# EAGLE schematic EstlCam board v3 (EAGLE 9.3.1)
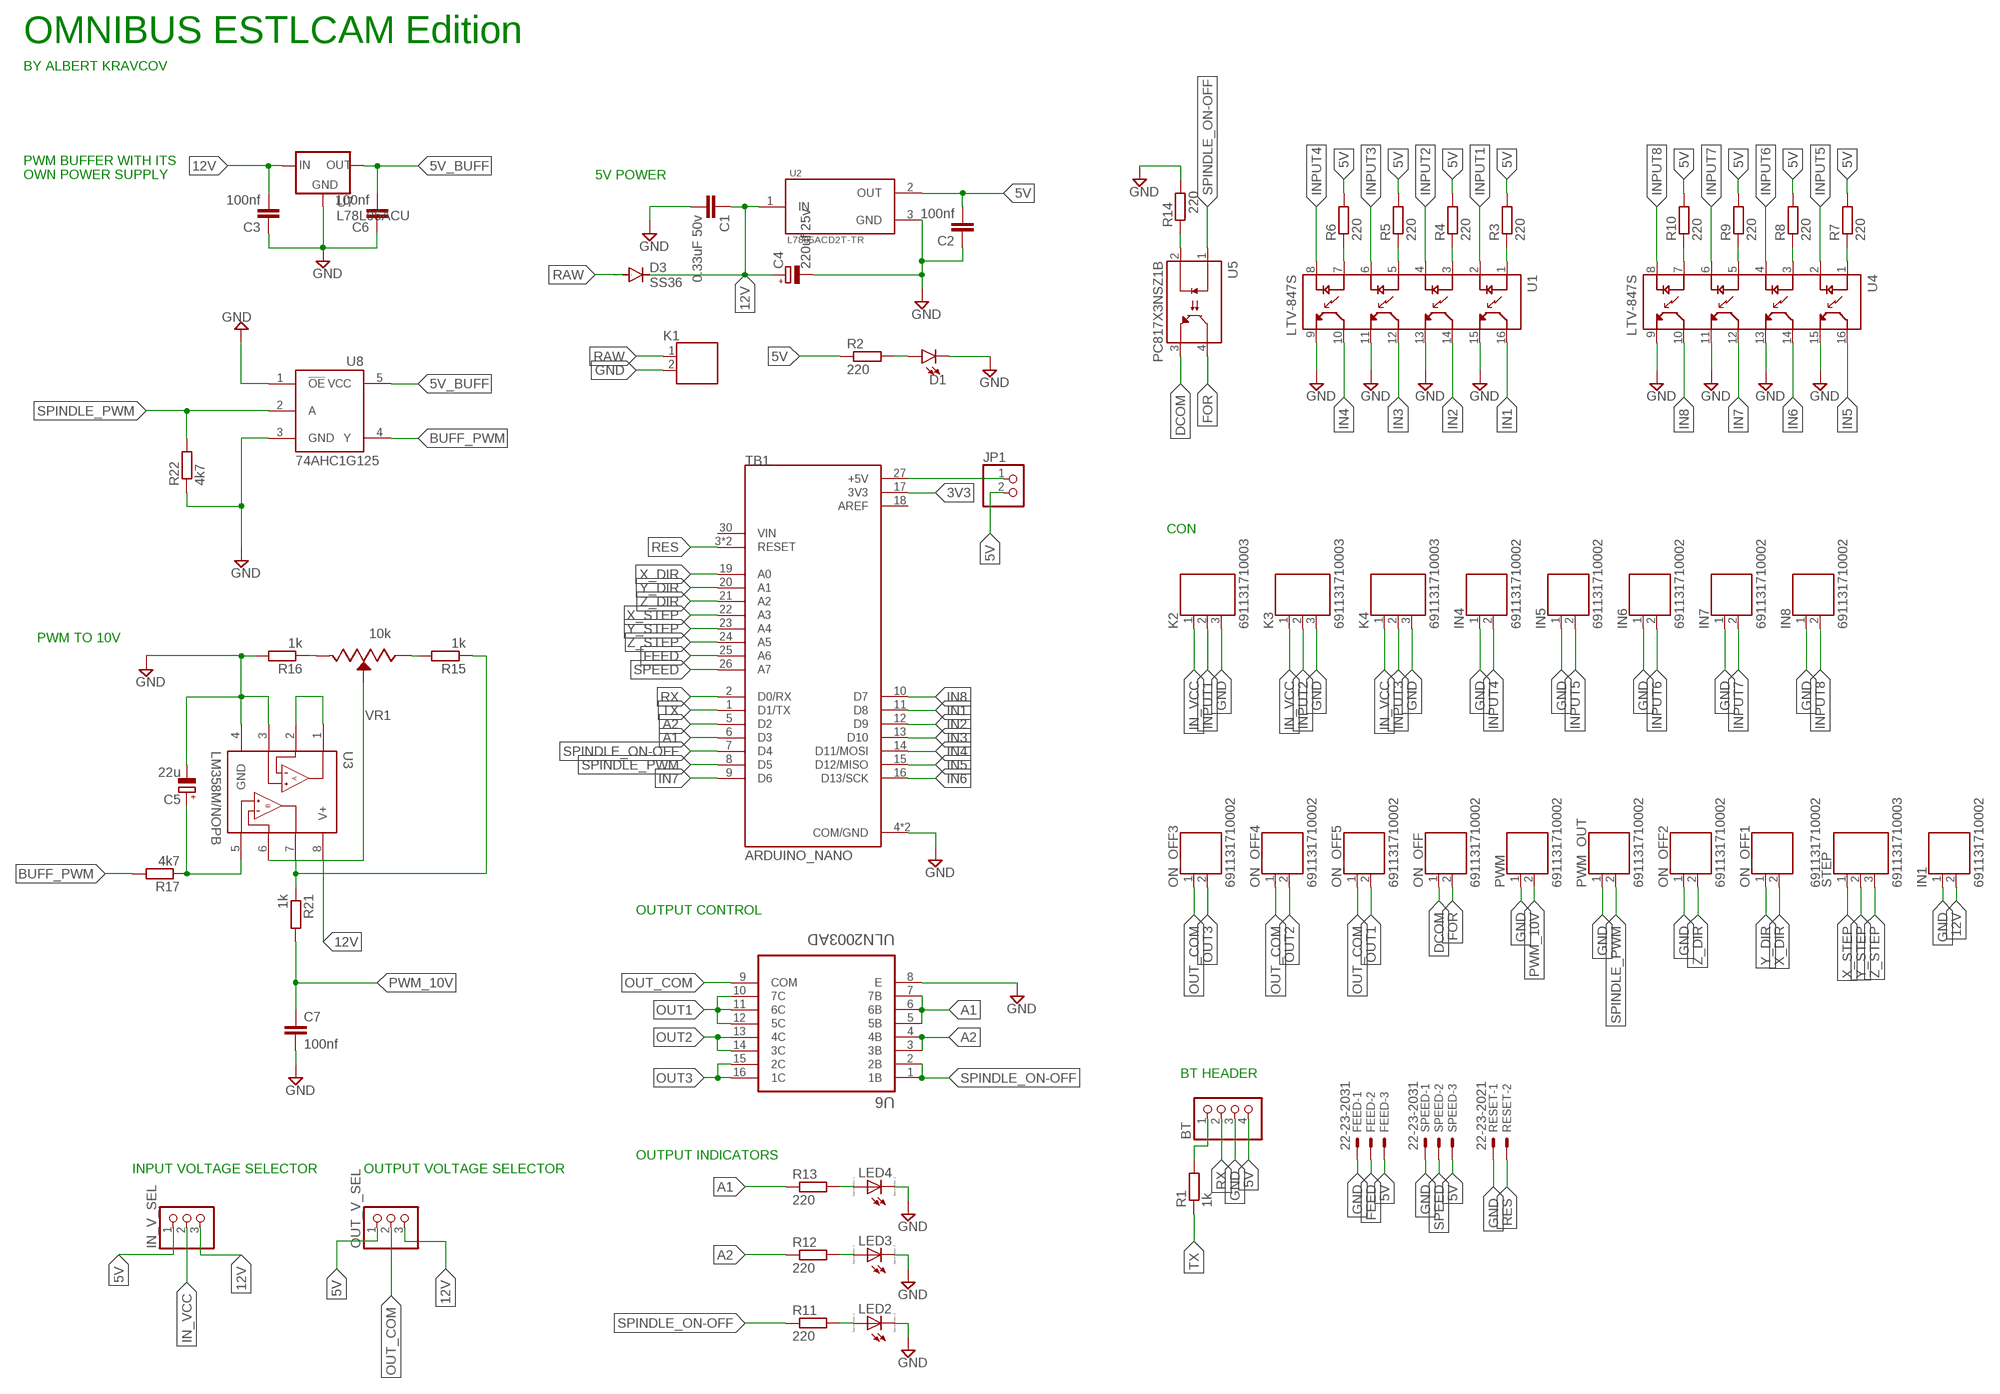
[diagram p0: schematic, sheet 1]

## Parts
BT  PINHD-1X4  [1X04]
C1  0.33uF 50v  C-EUC1206  [C1206]
C2  100nf  C-EUC0805  [C0805]
C3  100nf  C-EUC0805  [C0805]
C4  220uf 25v  CPOL-EUE5-6  [E5-6]
C5  22u  CPOL-EUE2-5  [E2-5]
C6  100nf  C-EUC0805  [C0805]
C7  100nf  C-EUC0805  [C0805]
D1  LED1206  [LED-1206]
D3  SS36  ES2D  [SMB]
FEED  22-23-2031  [22-23-2031]
IN1  691131710002  [691131710002]
IN4  691131710002  [691131710002]
IN5  691131710002  [691131710002]
IN6  691131710002  [691131710002]
IN7  691131710002  [691131710002]
IN8  691131710002  [691131710002]
IN_V_SEL  PINHD-1X3  [1X03]
JP1  PINHD-1X2  [1X02]
K1  691131710002  [691131710002]
K2  691131710003  [691131710003]
K3  691131710003  [691131710003]
K4  691131710003  [691131710003]
LED2  LED_ESML0603  [LED_SML0603]
LED3  LED_ESML0603  [LED_SML0603]
LED4  LED_ESML0603  [LED_SML0603]
ON_OFF  691131710002  [691131710002]
ON_OFF1  691131710002  [691131710002]
ON_OFF2  691131710002  [691131710002]
ON_OFF3  691131710002  [691131710002]
ON_OFF4  691131710002  [691131710002]
ON_OFF5  691131710002  [691131710002]
OUT_V_SEL  PINHD-1X3  [1X03]
PWM  691131710002  [691131710002]
PWM_OUT  691131710002  [691131710002]
R1  1k  R-EU_R0805  [R0805]
R2  220  R-EU_R0805  [R0805]
R3  220  R-EU_R0805  [R0805]
R4  220  R-EU_R0805  [R0805]
R5  220  R-EU_R0805  [R0805]
R6  220  R-EU_R0805  [R0805]
R7  220  R-EU_R0805  [R0805]
R8  220  R-EU_R0805  [R0805]
R9  220  R-EU_R0805  [R0805]
R10  220  R-EU_R0805  [R0805]
R11  220  R-EU_R0603  [R0603]
R12  220  R-EU_R0603  [R0603]
R13  220  R-EU_R0603  [R0603]
R14  220  R-EU_R0805  [R0805]
R15  1k  R-EU_R0805  [R0805]
R16  1k  R-EU_R0805  [R0805]
R17  4k7  R-EU_R0603  [R0603]
R21  1k  R-EU_R0805  [R0805]
R22  4k7  R-EU_R0805  [R0805]
RESET  22-23-2021  [22-23-2021]
SPEED  22-23-2031  [22-23-2031]
STEP  691131710003  [691131710003]
TB1  ARDUINO_NANO  [SHIELD_ARDUINO_NANO]
U1  LTV-847S  [SOIC254P1016X460-16N]
U2  L7805ACD2T-TR  [TO254P1515X470-3N]
U3  LM358M/NOPB  [SOIC127P599X175-8N]
U4  LTV-847S  [SOIC254P1016X460-16N]
U5  PC817X3NSZ1B  [DIP762W50P254L495H455Q4]
U6  ULN2003AD  [SOIC127P600X175-16N]
U7  L78L05ACU  [SOT89]
U8  74AHC1G125  [SOT23-5L]
VR1  10k  3296W-1-502  [TRIM_3296W-1-502]

## Nets
3V3: TB1.17(3V3)
5V [power]: BT.4 C2.2 FEED.3 IN_V_SEL.1 JP1.2 OUT_V_SEL.1 R2.1 R3.2 R4.2 R5.2 R6.2 R7.2 R8.2 R9.2 R10.2 SPEED.3 U2.2(OUT)
5V_BUFF [power]: C6.2 U7.1(OUT) U8.5(VCC)
12V [power]: C1.1 C3.2 C4.+ D3.C IN1.2 IN_V_SEL.3 OUT_V_SEL.3 U2.1(IN) U3.8(V+) U7.3(IN)
A1 [sign]: R13.1 TB1.6(D3) U6.5(5B) U6.6(6B) U6.7(7B)
A2 [sign]: R12.1 TB1.5(D2) U6.3(3B) U6.4(4B)
ARDU5V [sign]: JP1.1 TB1.27(+5V)
BUFF_PWM [sign]: R17.2 U8.4(Y)
D [sign]: R15.1 R21.1 U3.7(OUTB)
DCOM [power]: ON_OFF.1 U5.3(EMITTER)
FEED [sign]: FEED.2 TB1.25(A6)
FOR [power]: ON_OFF.2 U5.4(COLLECTOR)
GND: BT.3 C1.2 C2.1 C3.1 C4.- C5.- C6.1 C7.2 D1.C FEED.1 IN1.1 IN4.1 IN5.1 IN6.1 IN7.1 IN8.1 K1.2 K2.3 K3.3 K4.3 LED2.C LED3.C LED4.C ON_OFF2.1 PWM.1 PWM_OUT.1 R14.2 R16.2 R22.1 RESET.1 SPEED.1 TB1.4(COM/GND) TB1.29(COM/GND) U1.9(ET3) U1.11(ET2) U1.13(ET1) U1.15(ET) U2.3(GND) U3.3(+INA) U3.4(GND) U4.9(ET3) U4.11(ET2) U4.13(ET1) U4.15(ET) U6.8(E) U7.2(GND) U8.1(!OE) U8.3(GND)
IN1 [sign]: TB1.11(D8) U1.16(CT)
IN2 [sign]: TB1.12(D9) U1.14(CT1)
IN3 [sign]: TB1.13(D10) U1.12(CT2)
IN4 [sign]: TB1.14(D11/MOSI) U1.10(CT3)
IN5 [sign]: TB1.15(D12/MISO) U4.16(CT)
IN6 [sign]: TB1.16(D13/SCK) U4.14(CT1)
IN7 [sign]: TB1.9(D6) U4.12(CT2)
IN8 [sign]: TB1.10(D7) U4.10(CT3)
IN_VCC [power]: IN_V_SEL.2 K2.1 K3.1 K4.1
INPUT1 [sign]: K2.2 U1.2(C)
INPUT2 [sign]: K3.2 U1.4(C1)
INPUT3 [sign]: K4.2 U1.6(C2)
INPUT4 [sign]: IN4.2 U1.8(C3)
INPUT5 [sign]: IN5.2 U4.2(C)
INPUT6 [sign]: IN6.2 U4.4(C1)
INPUT7 [sign]: IN7.2 U4.6(C2)
INPUT8: IN8.2 U4.8(C3)
N$1: D1.A R2.2
N$2 [sign]: R4.1 U1.3(A1)
N$3 [sign]: R5.1 U1.5(A2)
N$4 [sign]: R6.1 U1.7(A3)
N$5 [sign]: R3.1 U1.1(A)
N$6 [sign]: R7.1 U4.1(A)
N$7 [sign]: R8.1 U4.3(A1)
N$8 [sign]: R9.1 U4.5(A2)
N$9 [sign]: R10.1 U4.7(A3)
N$10 [sign]: LED3.A R12.2
N$11 [sign]: LED2.A R11.2
N$12 [sign]: LED4.A R13.2
N$13 [sign]: R14.1 U5.2(CATHODE)
N$14 [sign]: U3.6(-INB) VR1.2(WIPER)
N$15 [sign]: R15.2 VR1.1(CCW)
N$16 [sign]: R16.1 VR1.3(CW)
N$17 [sign]: C5.+ R17.1 U3.5(+INB)
N$18: U3.1(OUTA) U3.2(-INA)
N$19: BT.1 R1.2
OUT1: ON_OFF5.2 U6.10(7C) U6.11(6C) U6.12(5C)
OUT2: ON_OFF4.2 U6.13(4C) U6.14(3C)
OUT3: ON_OFF3.2 U6.15(2C) U6.16(1C)
OUT_COM [power]: ON_OFF3.1 ON_OFF4.1 ON_OFF5.1 OUT_V_SEL.2 U6.9(COM)
PWM_10V [sign]: C7.1 PWM.2 R21.2
RAW [power]: D3.A K1.1
RES [sign]: RESET.2 TB1.3(RESET) TB1.28(RESET)
RX [sign]: BT.2 TB1.2(D0/RX)
SPEED [sign]: SPEED.2 TB1.26(A7)
SPINDLE_ON-OFF [sign]: R11.1 TB1.7(D4) U5.1(ANODE) U6.1(1B) U6.2(2B)
SPINDLE_PWM [sign]: PWM_OUT.2 R22.2 TB1.8(D5) U8.2(A)
TX: R1.1 TB1.1(D1/TX)
X_DIR [sign]: ON_OFF1.2 TB1.19(A0)
X_STEP [sign]: STEP.1 TB1.22(A3)
Y_DIR [sign]: ON_OFF1.1 TB1.20(A1)
Y_STEP [sign]: STEP.2 TB1.23(A4)
Z_DIR [sign]: ON_OFF2.2 TB1.21(A2)
Z_STEP [sign]: STEP.3 TB1.24(A5)
Unconnected: TB1.30(VIN)

## Notes on the sheet
- OMNIBUS ESTLCAM Edition
- BY ALBERT KRAVCOV
- PWM BUFFER WITH ITS
  OWN POWER SUPPLY
- 5V POWER
- CON
- PWM TO 10V
- OUTPUT CONTROL
- BT HEADER
- OUTPUT INDICATORS
- INPUT VOLTAGE SELECTOR | OUTPUT VOLTAGE SELECTOR

## Power pins joined to a net without a drawn wire
AREF: TB1.18(AREF)

## Library data of the parts
BT = pinhead:PINHD-1X4: PIN HEADER
C1-C3 C6 C7 = rcl:C-EU: CAPACITOR, European symbol; SPICEPREFIX: C
C4 C5 = rcl:CPOL-EU: POLARIZED CAPACITOR, European symbol; SPICEPREFIX: C
D1 = SparkFun-LED:LED: LED (Generic) Standard schematic elements and footprints for 5mm, 3mm, 1206, and 0603 sized LEDs. Generic LEDs with no color specified.
D3 = diode:ES2D: DIODE super fast rectifier, 2 A
FEED SPEED = con-molex:22-23-2031: .100" (2.54mm) Center Header - 3 Pin; MF: MOLEX; MPN: 22-23-2031; OC_FARNELL: 1462950; OC_NEWARK: 30C0862
IN1 IN4-IN8 K1 ON_OFF ON_OFF1-ON_OFF5 PWM PWM_OUT = Wurth_Terminal_Blocks_Connectors_rev15d:691131710002: WR-TBL Terminal block - CUU5/2 CUU5/2GR - 2 Pins;=>Code : Con_TBL_Screw_PClamp_5.00_6911317100xx_691131710002 <http://katalog.we-online.de/media/images/eican/Con_TBL_Screw_PClamp_5.00_6911317100xx_pf2.jpg> Details see: http://katalog.we-online.de/em/datasheet/6911317100xx.pdf Created 11/23/2014, Karrer Zheng 2014 (C) Wurth Elektronik
IN_V_SEL OUT_V_SEL = pinhead:PINHD-1X3: PIN HEADER
JP1 = pinhead:PINHD-1X2: PIN HEADER
K2-K4 STEP = Wurth_Terminal_Blocks_Connectors_rev15d:691131710003: WR-TBL Terminal block - CUU5/3 - 3 Pins;=>Code : Con_TBL_Screw_PClamp_5.00_6911317100xx_691131710003 <http://katalog.we-online.de/media/images/eican/Con_TBL_Screw_PClamp_5.00_6911317100xx_pf2.jpg> Details see: http://katalog.we-online.de/em/datasheet/6911317100xx.pdf Created 11/3/2014, Karrer Zheng 2014 (C) Wurth Elektronik
LED2-LED4 = eagle-ltspice:LED_E: LED Source: http://www.osram.convergy.de Source: www.luxeon.com Source: www.kingbright.com; SPICEMODEL: NONE; SPICEPREFIX: D; SPICETYPE: diode
R1-R17 R21 R22 = rcl:R-EU_: RESISTOR, European symbol; SPICEPREFIX: R
RESET = con-molex:22-23-2021: .100" (2.54mm) Center Header - 2 Pin; MF: MOLEX; MPN: 22-23-2021; OC_FARNELL: 1462926; OC_NEWARK: 25C3832
TB1 = ARDUINO_NANO-2:ARDUINO_NANO: Arduino Nano, Through Hole; AVAILABILITY: Unavailable; DESCRIPTION: ATmega4809 Arduino Nano Every with Headers AVR® AVR MCU 8-Bit Embedded Evaluation Board; MF: Arduino; MP: ARDUINO NANO; PACKAGE: None; PRICE: None
U1 U4 = LTV-847S:LTV-847S: Optocoupler DC-IN 4-CH Transistor DC-OUT 16-Pin PDIP SMD Check prices <https://pricing.snapeda.com/parts/LTV-847S/Lite-On%20Inc./view-part?ref=eda>; AVAILABILITY: Bad; DESCRIPTION: Optoisolator Transistor Output 5000Vrms 4 Channel 16-SMD; MF: Lite-On Inc.; MP: LTV-847S; PACKAGE: SMD-16 Lite-On; PRICE: None; PURCHASE-URL: https://pricing.snapeda.com/search/part/LTV-847S/?ref=eda
U2 = L7805ACD2T-TR:L7805ACD2T-TR: Positive voltage regulator ICs Check prices <https://pricing.snapeda.com/parts/L7805ACD2T-TR/STMicroelectronics/view-part?ref=eda>; AVAILABILITY: Good; DESCRIPTION: Linear Voltage Regulator IC Positive Fixed 1 Output 1.5A D2PAK; MF: STMicroelectronics; MP: L7805ACD2T-TR; PACKAGE: D2PAK STMicroelectronics; PRICE: None; PURCHASE-URL: https://pricing.snapeda.com/search/part/L7805ACD2T-TR/?ref=eda
U3 = LM358M_NOPB:LM358M/NOPB: Check prices <https://snapeda.com/parts/LM358M/NOPB/NOPB/Texas%20Instruments/view-part/?ref=eda> Check prices <https://pricing.snapeda.com/parts/LM358M/Texas%20Instruments/view-part?ref=eda>; AVAILABILITY: Warning; DESCRIPTION: 2-Channel, 1MHz, industry standard, 32V op amp 8-SOIC 0 to 70; MF: Texas Instruments; MP: LM358M; PACKAGE: SOIC-8 Texas Instruments; PRICE: None; PURCHASE-URL: https://pricing.snapeda.com/search/part/LM358M/?ref=eda
U5 = PC817X3NSZ1B:PC817X3NSZ1B: Optoisolator Transistor Output 1 Channel 4-DIP Check prices <https://pricing.snapeda.com/parts/PC817X3NSZ1B/Sharp%20Microelectronics/view-part?ref=eda>; AVAILABILITY: Bad; DESCRIPTION: Optoisolator Transistor Output 1 Channel 4-DIP; MF: Sharp Microelectronics; MP: PC817X3NSZ1B; PACKAGE: None; PRICE: None; PURCHASE-URL: https://pricing.snapeda.com/search/part/PC817X3NSZ1B/?ref=eda
U6 = ULN2003AD:ULN2003AD: Check prices <https://pricing.snapeda.com/parts/ULN2003AD/Texas%20Instruments/view-part?ref=eda>; AVAILABILITY: Warning; DESCRIPTION: 50-V, 7-ch darlington transistor array, -20C to 70C 16-SOIC -40 to 70; MF: Texas Instruments; MP: ULN2003AD; PACKAGE: SOIC-16 Texas Instruments; PRICE: None; PURCHASE-URL: https://pricing.snapeda.com/search/part/ULN2003AD/?ref=eda
U7 = L78L05ACU:L78L05ACU: 5V Positive voltage regulator SMD SOT89 Package; AVAILABILITY: Unavailable; DESCRIPTION: Linear Voltage Regulator IC Positive Fixed 1 Output 100mA SOT-89-3; MF: STMicroelectronics; MP: L78L05ACU; PACKAGE: SOT-89-3 STMicroelectronics; PRICE: None
U8 = 74AHC1G125:74AHC1G125; AVAILABILITY: Unavailable; DESCRIPTION: Buffer, Non-Inverting 1 Element 1 Bit per Element 3-State Output SOT-23-5; MF: Texas Instruments; MP: 74AHC1G125; PACKAGE: SOT-23 Texas Instruments; PRICE: None
VR1 = 3296W-1-502:3296W-1-502: Res Cermet Trimmer 500K Ohm 10% 0.5W 25(Elec)Turn 2.19mm (9.53 X 4.83 X 11.55mm) Pin Thru-Hole Tube Check prices <https://pricing.snapeda.com/parts/3296W-1-502/Bourns/view-part?ref=eda>; AVAILABILITY: Warning; DESCRIPTION: 5 kOhms 0.5W, 1/2W PC Pins Through Hole Trimmer Potentiometer Cermet 25 Turn Top Adjustment; MF: Bourns; MP: 3296W-1-502; PACKAGE: SOT-23-5 Bourns; PRICE: None; PURCHASE-URL: https://pricing.snapeda.com/search/part/3296W-1-502/?ref=eda

## Net classes
0 default: width 0.305 mm, drill 0.305 mm, clearance 0.305 mm
1 power: width 0.635 mm, drill 0.635 mm, clearance 0.635 mm
2 sign: width 0.508 mm, drill 0.508 mm, clearance 0.508 mm